# Altium project opm.PrjPcb (part 1 of 11)
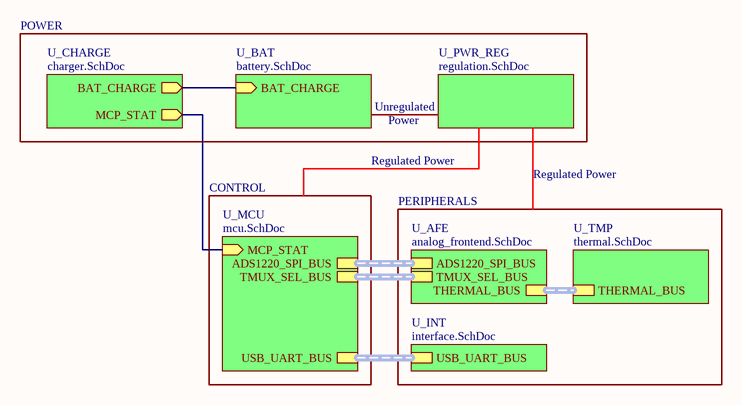
[diagram p0: opm.SchDoc]
11 sheets, 104 parts. Net scope: hierarchical (ports join the sheet entries above them; power ports are global).
Board file: opm.PcbDoc
Sheets:
  opm.SchDoc
    U_AFE = analog_frontend.SchDoc
      U_TIA2 = tia2.SchDoc
      U_TIA1 = tia1.SchDoc
      U_TIA3 = tia3.SchDoc
    U_MCU = mcu.SchDoc
    U_INT = interface.SchDoc
    U_BAT = battery.SchDoc
    U_CHARGE = charger.SchDoc
    U_PWR_REG = regulation.SchDoc
    U_TMP = thermal.SchDoc

## Sheet opm.SchDoc: Optical Power Meter
size A4; Date: 03-09-2026; Author: Peilin Perry Xu; CompanyName: N/A; DrawnBy: Peilin Perry Xu; Engineer: Peilin Perry Xu; Organization: N/A; Address1: 89 Chestnut Street, Toronto, ON, Canada; Address2: 79 Brass Drive, Richmond Hill, ON, Canada; DocumentNumber: 1; Revision: 1; SheetNumber: 1; SheetTotal: 11

### Sub-sheets
U_AFE = analog_frontend.SchDoc: ADS1220_SPI_BUS (harness ADS1220_SPI_BUS), TMUX_SEL_BUS (harness TMUX_SEL_BUS), THERMAL_BUS (harness THERMAL_BUS)
U_BAT = battery.SchDoc: BAT_CHARGE (in)
U_CHARGE = charger.SchDoc: BAT_CHARGE (out), MCP_STAT (out)
U_INT = interface.SchDoc: USB_UART_BUS (harness USB_UART_BUS)
U_MCU = mcu.SchDoc: USB_UART_BUS (harness USB_UART_BUS), ADS1220_SPI_BUS (harness ADS1220_SPI_BUS), TMUX_SEL_BUS (harness TMUX_SEL_BUS), MCP_STAT (in)
U_PWR_REG = regulation.SchDoc: no entries
U_TMP = thermal.SchDoc: THERMAL_BUS (harness THERMAL_BUS)

### Nets
NetC34_1: sheet U_BAT/BAT_CHARGE, sheet U_CHARGE/BAT_CHARGE
NetR16_2: sheet U_MCU/MCP_STAT, sheet U_CHARGE/MCP_STAT

### Buses and harness runs
harness sheet U_AFE/ADS1220_SPI_BUS = sheet U_MCU/ADS1220_SPI_BUS
harness sheet U_AFE/THERMAL_BUS = sheet U_TMP/THERMAL_BUS
harness sheet U_AFE/TMUX_SEL_BUS = sheet U_MCU/TMUX_SEL_BUS
harness sheet U_INT/USB_UART_BUS = sheet U_MCU/USB_UART_BUS

### Notes on the sheet
- POWER
- Unregulated
- Power
- CONTROL
- Regulated Power
- PERIPHERALS

## Sheet analog_frontend.SchDoc: Analog Frontend
size A4; Author: Peilin Perry Xu; CompanyName: N/A; DrawnBy: Peilin Perry Xu; Engineer: Peilin Perry Xu; Organization: N/A; Address1: 89 Chestnut Street, Toronto, ON, Canada; Address2: 79 Brass Drive, Richmond Hill, ON, Canada; DocumentNumber: 2; Revision: 1; SheetNumber: 2; SheetTotal: 11
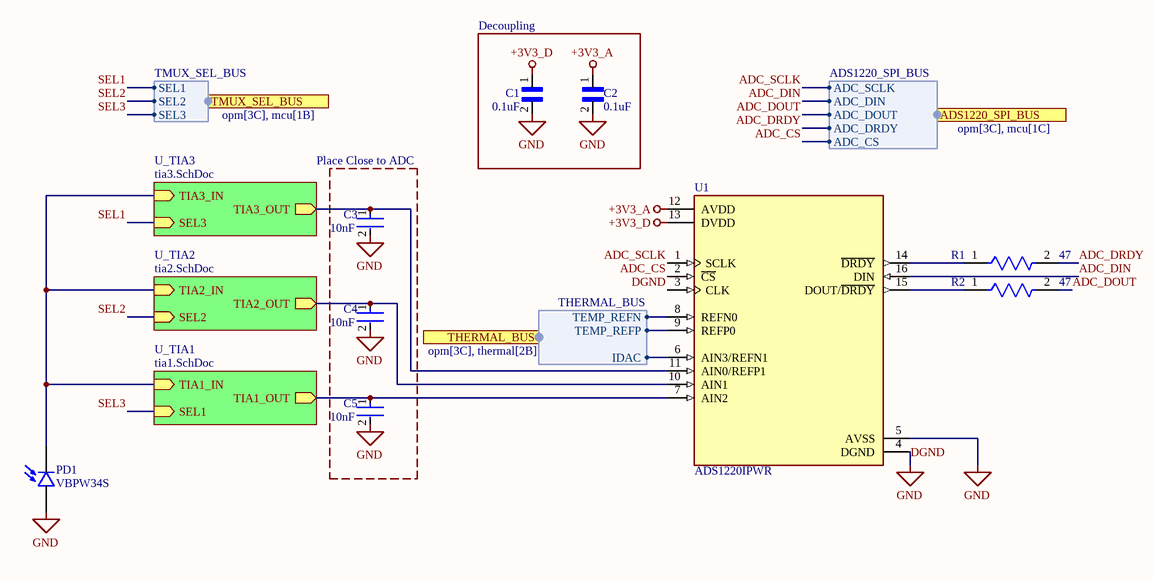
[diagram p1: analog_frontend.SchDoc]

### Parts
C1  0.1uF  [CC0603JRX7R8BB104]
C2  0.1uF  [CC0603JRX7R8BB104]
C3  10nF  [GRM1885C1H103JA01D]
C4  10nF  [GRM1885C1H103JA01D]
C5  10nF  [GRM1885C1H103JA01D]
PD1  VBPW34S  [XDCR_VBPW34S]
R1  47  [RC0603FR-07]
R2  47  [RC0603FR-07]
U1  ADS1220IPWR  [ADS1220IPWR]

### Blocks framed on the sheet
Decoupling: C1 C2

### Sub-sheets
U_TIA1 = tia1.SchDoc: TIA1_IN (in), TIA1_OUT (out), SEL1 (in)
U_TIA2 = tia2.SchDoc: TIA2_IN (in), TIA2_OUT (out), SEL2 (in)
U_TIA3 = tia3.SchDoc: TIA3_IN (in), TIA3_OUT (out), SEL3 (in)

### Ports
ADS1220_SPI_BUS (harness ADS1220_SPI_BUS, see opm[3C], mcu[1C]), THERMAL_BUS (harness THERMAL_BUS, see opm[3C], thermal[2B]), TMUX_SEL_BUS (harness TMUX_SEL_BUS, see opm[3C], mcu[1B])

### Harnesses
ADS1220_SPI_BUS: ADC_SCLK, ADC_DIN, ADC_DOUT, ADC_CS, ADC_DRDY
TMUX_SEL_BUS: SEL1, SEL2, SEL3
THERMAL_BUS: TEMP_REFN, TEMP_REFP, IDAC

### Nets
+3V3_A: C2.1 U1.12(AVDD)
+3V3_D: C1.1 U1.13(DVDD)
DGND: C1.2 C2.2 C3.2 C4.2 C5.2 PD1.A U1.3(CLK) U1.4(DGND) U1.5(AVSS)  [also labelled GND]
ADC_CS: U1.2(~{CS}) ; port ADS1220_SPI_BUS.ADC_CS
ADC_DIN: U1.16(DIN) ; port ADS1220_SPI_BUS.ADC_DIN
ADC_DOUT: R2.2 ; port ADS1220_SPI_BUS.ADC_DOUT
ADC_DRDY: R1.2 ; port ADS1220_SPI_BUS.ADC_DRDY
ADC_SCLK: U1.1(SCLK) ; port ADS1220_SPI_BUS.ADC_SCLK
SEL1: sheet U_TIA3/SEL3, port TMUX_SEL_BUS.SEL1
SEL2: sheet U_TIA2/SEL2, port TMUX_SEL_BUS.SEL2
SEL3: sheet U_TIA1/SEL1, port TMUX_SEL_BUS.SEL3
Temp_N: U1.8(REFN0) ; port THERMAL_BUS.TEMP_REFN
Temp_P: U1.9(REFP0) ; port THERMAL_BUS.TEMP_REFP
NetC3_1: C3.1 U1.11(AIN0/REFP1) ; sheet U_TIA3/TIA3_OUT
NetC4_1: C4.1 U1.10(AIN1) ; sheet U_TIA2/TIA2_OUT
NetC5_1: C5.1 U1.7(AIN2) ; sheet U_TIA1/TIA1_OUT
NetC43_1: U1.6(AIN3/REFN1) ; port THERMAL_BUS.IDAC
NetPD1_K: PD1.K(C) ; sheet U_TIA2/TIA2_IN, sheet U_TIA1/TIA1_IN, sheet U_TIA3/TIA3_IN
NetR1_1: R1.1 U1.14(~{DRDY})
NetR2_1: R2.1 U1.15(DOUT/~{DRDY})

### Notes on the sheet
- (near C3) Place Close to ADC

### Library data of the parts
C1 C2 = CC0603JRX7R8BB104: 25V 100nF X7R ±5% 0603 Multilayer Ceramic Capacitors MLCC - SMD/SMT ROHS; Manufacturer: Yageo Group; Supplier: DigiKey; Supplier Part Number: 311-1777-1-ND; Manufacturer Part Number: CC0603JRX7R8BB104; RoHS: Compliant; Category: Ceramic Capacitors; Stock: 156739; Pricing: 1=0.1, 10=0.056, 50=0.0386, 100=0.0333, 500=0.02444, 1000=0.02172 (USD); Value: 100nF; Case/Package: 0603; Case Code (Imperial): 0603; Case Code (Metric): 1608; China RoHS: Compliant; Composition: Ceramic; Depth: 800µm; Dielectric: X7R; Dielectric Material: Ceramic; Halogen Free: Halogen Free; Height: 800µm; Lead Free: Lead Free; Length: 1.6mm; Lifecycle Status: Production; Max Operating Temperature: 125°C; Min Operating Temperature: -55°C; Mounting Technology: Surface Mount; Number of Terminals: 2; Radiation Hardening: No; REACH SVHC: Yes; Schedule B: 8532240020, 8532240020|8532240020, 8532240020|8532240020|8532240020, 8532240020|8532240020|8532240020|8532240020; Termination: SMD/SMT; Thickness: 889µm; Tolerance: 5%; Voltage Rating: 25V; Voltage Rating (DC): 25V; Weight: 2.012816mg; Width: 800µm; ComponentLink1URL: https://datasheet.octopart.com:443/CC0603JRX7R8BB104-Yageo-datasheet-177165144.pdf?src-supplier=IHS; ComponentLink1Description: https://datasheet.octopart.com:443/CC0603JRX7R8BB104-Yageo-datasheet-177165144.pdf?src-supplier=IHS; ComponentLink2URL: https://datasheet.octopart.com:443/CC0603JRX7R8BB104-Yageo-datasheet-147453679.pdf?src-supplier=Farnell; ComponentLink2Description: https://datasheet.octopart.com:443/CC0603JRX7R8BB104-Yageo-datasheet-147453679.pdf?src-supplier=Farnell; ComponentLink3URL: https://datasheet.octopart.com:443/CC0603JRX7R8BB104-Yageo-datasheet-181968346.pdf?src-supplier=Farnell; ComponentLink3Description: https://datasheet.octopart.com:443/CC0603JRX7R8BB104-Yageo-datasheet-181968346.pdf?src-supplier=Farnell; ComponentLink4URL: https://datasheet.octopart.com:443/CC0603JRX7R8BB104-Yageo-datasheet-151948686.pdf?src-supplier=TME; ComponentLink4Description: https://datasheet.octopart.com:443/CC0603JRX7R8BB104-Yageo-datasheet-151948686.pdf?src-supplier=TME; ComponentLink5URL: https://datasheet.octopart.com/CC0603JRX7R8BB104-Yageo-datasheet-12526321.pdf; ComponentLink5Description: https://datasheet.octopart.com/CC0603JRX7R8BB104-Yageo-datasheet-12526321.pdf; ComponentLink6URL: https://datasheet.octopart.com/CC0603JRX7R8BB104-Yageo-datasheet-10883670.pdf; ComponentLink6Description: https://datasheet.octopart.com/CC0603JRX7R8BB104-Yageo-datasheet-10883670.pdf; ComponentLink7URL: https://datasheet.octopart.com:443/CC0603JRX7R8BB104-Yageo-datasheet-166511530.pdf?src-supplier=Future+Electronics; ComponentLink7Description: https://datasheet.octopart.com:443/CC0603JRX7R8BB104-Yageo-datasheet-166511530.pdf?src-supplier=Future+Electronics; ComponentLink8URL: https://datasheet.octopart.com:443/CC0603JRX7R8BB104-Yageo-datasheet-137700082.pdf?src-supplier=Future+Electronics; ComponentLink8Description: https://datasheet.octopart.com:443/CC0603JRX7R8BB104-Yageo-datasheet-137700082.pdf?src-supplier=Future+Electronics; ComponentLink9URL: https://datasheet.octopart.com:443/CC0603JRX7R8BB104-Yageo-datasheet-137700084.pdf?src-supplier=Future+Electronics; ComponentLink9Description: https://datasheet.octopart.com:443/CC0603JRX7R8BB104-Yageo-datasheet-137700084.pdf?src-supplier=Future+Electronics; ComponentLink10URL: https://datasheet.octopart.com:443/CC0603JRX7R8BB104-Yageo-datasheet-27626582.pdf?src-supplier=Future+Electronics; ComponentLink10Description: https://datasheet.octopart.com:443/CC0603JRX7R8BB104-Yageo-datasheet-27626582.pdf?src-supplier=Future+Electronics; ComponentLink11URL: https://datasheet.octopart.com:443/CC0603JRX7R8BB104-Yageo-datasheet-15895757.pdf?src-supplier=Future+Electronics; ComponentLink11Description: https://datasheet.octopart.com:443/CC0603JRX7R8BB104-Yageo-datasheet-15895757.pdf?src-supplier=Future+Electronics; ComponentLink12URL: https://datasheet.octopart.com:443/CC0603JRX7R8BB104-Yageo-datasheet-10911834.pdf?src-supplier=Future+Electronics; ComponentLink12Description: https://datasheet.octopart.com:443/CC0603JRX7R8BB104-Yageo-datasheet-10911834.pdf?src-supplier=Future+Electronics; ComponentLink13URL: https://datasheet.octopart.com:443/CC0603JRX7R8BB104-Yageo-datasheet-8324442.pdf?src-supplier=Future+Electronics; ComponentLink13Description: https://datasheet.octopart.com:443/CC0603JRX7R8BB104-Yageo-datasheet-8324442.pdf?src-supplier=Future+Electronics; ComponentLink14URL: https://datasheet.octopart.com:443/CC0603JRX7R8BB104-Yageo-Group-datasheet-165992755.pdf?src-supplier=ODG+(Origin+Data+Global); ComponentLink14Description: https://datasheet.octopart.com:443/CC0603JRX7R8BB104-Yageo-Group-datasheet-165992755.pdf?src-supplier=ODG+(Origin+Data+Global); ComponentLink15URL: http://sigma.octopart.com:80/rohs_statement/Surface-Mount-Ceramic-Multilayer-Capacitors%3B-General-Purpose-%26-High-Capacitance-Class-2%2C-X7R-Yageo-family-124.pdf?src-supplier=Compliance+Statements; ComponentLink15Description: http://sigma.octopart.com:80/rohs_statement/Surface-Mount-Ceramic-Multilayer-Capacitors%3B-General-Purpose-%26-High-Capacitance-Class-2%2C-X7R-Yageo-family-124.pdf?src-supplier=Compliance+Statements; ComponentLink16URL: http://sigma.octopart.com:80/reach_statement/Surface-Mount-Ceramic-Multilayer-Capacitors%3B-General-Purpose-%26-High-Capacitance-Class-2%2C-X7R-Yageo-family-125.pdf?src-supplier=Compliance+Statements; ComponentLink16Description: http://sigma.octopart.com:80/reach_statement/Surface-Mount-Ceramic-Multilayer-Capacitors%3B-General-Purpose-%26-High-Capacitance-Class-2%2C-X7R-Yageo-family-125.pdf?src-supplier=Compliance+Statements; ComponentLink17URL: http://sigma.octopart.com:80/conflict_mineral_statement/Yageo-company-3.pdf?src-supplier=Compliance+Statements; ComponentLink17Description: http://sigma.octopart.com:80/conflict_mineral_statement/Yageo-company-3.pdf?src-supplier=Compliance+Statements; ComponentLink18URL: http://sigma.octopart.com:80/rohs_statement/Yageo-company-2.pdf?src-supplier=Compliance+Statements; ComponentLink18Description: http://sigma.octopart.com:80/rohs_statement/Yageo-company-2.pdf?src-supplier=Compliance+Statements; Supplier 1: DigiKey; Supplier Part Number 1: 311-1777-1-ND
C3-C5 = GRM1885C1H103JA01D: Multilayer Ceramic Capacitor, Grm Series, 0.01 F, 5%, C0g / Np0, 50 V, 0603 [1608 Metric]; Manufacturer: Murata; Manufacturer Lifecycle Status: IN PRODUCTION; Temperature Coefficient: 30ppm/°C; Voltage: 50V; Supplier: DigiKey; Supplier Part Number: 490-9666-1-ND; Manufacturer Part Number: GRM1885C1H103JA01D; RoHS: Compliant; Category: Ceramic Capacitors; Stock: 561745; Pricing: 1=0.12, 10=0.064, 50=0.0446, 100=0.0386, 500=0.02864, 1000=0.02721 (USD); Value: 10nF; Case/Package: 0603; Case Code (Imperial): 0603; Case Code (Metric): 1608; Depth: 800µm; Dielectric: C0G; Dielectric Material: Ceramic; Height: 800µm; Lead Free: Lead Free; Lead Pitch: 500µm; Length: 1.6mm; Lifecycle Status: Production; Material: Ceramic; Max Operating Temperature: 125°C; Min Operating Temperature: -55°C; Mounting Technology: Surface Mount; Number of Terminals: 2; Packaging: Cut Tape; REACH SVHC: Yes; Schedule B: 8532240020, 8532240020|8532240020, 8532240020|8532240020|8532240020, 8532240020|8532240020|8532240020|8532240020; Termination: SMD/SMT; Thickness: 800µm; Tolerance: 5%; Voltage Rating: 50V; Voltage Rating (DC): 50V; Width: 800µm; ComponentLink1URL: https://datasheet.octopart.com:443/GRM1885C1H103JA01D-Murata-datasheet-34231350.pdf?src-supplier=Newark; ComponentLink1Description: https://datasheet.octopart.com:443/GRM1885C1H103JA01D-Murata-datasheet-34231350.pdf?src-supplier=Newark; ComponentLink2URL: https://datasheet.octopart.com:443/GRM1885C1H103JA01D-Murata-datasheet-62317145.pdf?src-supplier=element14+APAC; ComponentLink2Description: https://datasheet.octopart.com:443/GRM1885C1H103JA01D-Murata-datasheet-62317145.pdf?src-supplier=element14+APAC; ComponentLink3URL: https://datasheet.octopart.com:443/GRM1885C1H103JA01D-Murata-datasheet-15634865.pdf?src-supplier=Future+Electronics; ComponentLink3Description: https://datasheet.octopart.com:443/GRM1885C1H103JA01D-Murata-datasheet-15634865.pdf?src-supplier=Future+Electronics; ComponentLink4URL: https://datasheet.octopart.com:443/GRM1885C1H103JA01D-Murata-datasheet-22122223.pdf?src-supplier=Future+Electronics; ComponentLink4Description: https://datasheet.octopart.com:443/GRM1885C1H103JA01D-Murata-datasheet-22122223.pdf?src-supplier=Future+Electronics; ComponentLink5URL: https://datasheet.octopart.com:443/GRM1885C1H103JA01D-Murata-datasheet-44106831.pdf?src-supplier=Future+Electronics; ComponentLink5Description: https://datasheet.octopart.com:443/GRM1885C1H103JA01D-Murata-datasheet-44106831.pdf?src-supplier=Future+Electronics; ComponentLink6URL: https://datasheet.octopart.com:443/GRM1885C1H103JA01D-Murata-datasheet-165579666.pdf?src-supplier=TME; ComponentLink6Description: https://datasheet.octopart.com:443/GRM1885C1H103JA01D-Murata-datasheet-165579666.pdf?src-supplier=TME; ComponentLink7URL: https://datasheet.octopart.com:443/GRM1885C1H103JA01D-Murata-datasheet-86177052.pdf?src-supplier=TME; ComponentLink7Description: https://datasheet.octopart.com:443/GRM1885C1H103JA01D-Murata-datasheet-86177052.pdf?src-supplier=TME; ComponentLink8URL: https://datasheet.octopart.com:443/GRM1885C1H103JA01D-Murata-datasheet-141274262.pdf?src-supplier=Ciiva; ComponentLink8Description: https://datasheet.octopart.com:443/GRM1885C1H103JA01D-Murata-datasheet-141274262.pdf?src-supplier=Ciiva; ComponentLink9URL: https://datasheet.octopart.com:443/GRM1885C1H103JA01D-Murata-datasheet-140695819.pdf?src-supplier=Ciiva; ComponentLink9Description: https://datasheet.octopart.com:443/GRM1885C1H103JA01D-Murata-datasheet-140695819.pdf?src-supplier=Ciiva; ComponentLink10URL: https://datasheet.octopart.com:443/GRM1885C1H103JA01D-Murata-datasheet-138741457.pdf?src-supplier=Ciiva; ComponentLink10Description: https://datasheet.octopart.com:443/GRM1885C1H103JA01D-Murata-datasheet-138741457.pdf?src-supplier=Ciiva; ComponentLink11URL: https://datasheet.octopart.com/GRM1885C1H103JA01D-Murata-datasheet-12515295.pdf; ComponentLink11Description: https://datasheet.octopart.com/GRM1885C1H103JA01D-Murata-datasheet-12515295.pdf; ComponentLink12URL: https://datasheet.octopart.com/GRM1885C1H103JA01D-Murata-datasheet-12510076.pdf; ComponentLink12Description: https://datasheet.octopart.com/GRM1885C1H103JA01D-Murata-datasheet-12510076.pdf; ComponentLink13URL: https://datasheet.octopart.com/GRM1885C1H103JA01D-Murata-datasheet-11978611.pdf; ComponentLink13Description: https://datasheet.octopart.com/GRM1885C1H103JA01D-Murata-datasheet-11978611.pdf; ComponentLink14URL: https://datasheet.octopart.com/GRM1885C1H103JA01D-Murata-datasheet-10025737.pdf; ComponentLink14Description: https://datasheet.octopart.com/GRM1885C1H103JA01D-Murata-datasheet-10025737.pdf; ComponentLink15URL: https://datasheet.octopart.com/GRM1885C1H103JA01D-Murata-datasheet-8819587.pdf; ComponentLink15Description: https://datasheet.octopart.com/GRM1885C1H103JA01D-Murata-datasheet-8819587.pdf; ComponentLink16URL: http://sigma.octopart.com:80/reach_statement/Murata-company-16.pdf?src-supplier=Compliance+Statements; ComponentLink16Description: http://sigma.octopart.com:80/reach_statement/Murata-company-16.pdf?src-supplier=Compliance+Statements; Supplier 1: DigiKey; Supplier Part Number 1: 490-9666-1-ND
PD1 = VBPW34S: IR-photodiode Photoelectric current: 45...55 uA Wavelength of max. photosensitivity: 940 nm; Manufacturer: Vishay; Breakdown Voltage: 60V; Dark Current: 30nA; Diode Type: PIN; Fall Time: 100ns; Forward Current: 50mA; Forward Voltage: 1.3V; Max Power Dissipation: 215mW; Number of Circuits: 1; Peak Wavelength: 940nm; Viewing Angle: 130°; Supplier: DigiKey; Supplier Part Number: 751-1500-6-ND; Manufacturer Part Number: VBPW34S; RoHS: Compliant; Category: Photodiodes; Stock: 49982; Pricing: 1=1.17, 10=0.822, 100=0.6118, 500=0.5182 (USD); Case/Package: SMD/SMT; Contact Plating: Tin; Height: 1.2mm; Introduction Date: 2009-10-04; Lead Free: Lead Free; Length: 4.4mm; Lifecycle Status: Production; Max Operating Temperature: 100°C; Max Reverse Voltage (DC): 60V; Min Operating Temperature: -40°C; Mounting Technology: Surface Mount; Pins: 2; Power Dissipation: 215mW; Radiation Hardening: No; REACH SVHC: Yes; Response Time: 100ns; Reverse Breakdown Voltage: 60V; Reverse Voltage: 60V; Reverse Voltage (DC): 60V; Rise Time: 100ns; Schedule B: 8541406010, 8541406010|8541406010|8541406010|8541406010|8541406010; Wavelength: 940nm; Width: 3.9mm; ComponentLink1URL: https://datasheet.octopart.com:443/VBPW34S-Vishay-datasheet-181477396.pdf?src-supplier=IHS; ComponentLink1Description: https://datasheet.octopart.com:443/VBPW34S-Vishay-datasheet-181477396.pdf?src-supplier=IHS; ComponentLink2URL: https://datasheet.octopart.com:443/VBPW34S-Vishay-datasheet-141435336.pdf?src-supplier=Upverter; ComponentLink2Description: https://datasheet.octopart.com:443/VBPW34S-Vishay-datasheet-141435336.pdf?src-supplier=Upverter; ComponentLink3URL: https://datasheet.octopart.com:443/VBPW34S-Vishay-datasheet-8636772.pdf?src-supplier=Farnell; ComponentLink3Description: https://datasheet.octopart.com:443/VBPW34S-Vishay-datasheet-8636772.pdf?src-supplier=Farnell; ComponentLink4URL: https://datasheet.octopart.com:443/VBPW34S-Vishay-datasheet-24897338.pdf?src-supplier=Farnell; ComponentLink4Description: https://datasheet.octopart.com:443/VBPW34S-Vishay-datasheet-24897338.pdf?src-supplier=Farnell; ComponentLink5URL: https://datasheet.octopart.com:443/VBPW34S-Vishay-datasheet-41195834.pdf?src-supplier=Farnell; ComponentLink5Description: https://datasheet.octopart.com:443/VBPW34S-Vishay-datasheet-41195834.pdf?src-supplier=Farnell; ComponentLink6URL: https://datasheet.octopart.com:443/VBPW34S-Vishay-datasheet-62319496.pdf?src-supplier=Newark; ComponentLink6Description: https://datasheet.octopart.com:443/VBPW34S-Vishay-datasheet-62319496.pdf?src-supplier=Newark; ComponentLink7URL: https://datasheet.octopart.com:443/VBPW34S-Vishay-datasheet-8820987.pdf?src-supplier=element14+APAC; ComponentLink7Description: https://datasheet.octopart.com:443/VBPW34S-Vishay-datasheet-8820987.pdf?src-supplier=element14+APAC; ComponentLink8URL: https://datasheet.octopart.com:443/VBPW34S-Vishay-datasheet-108049364.pdf?src-supplier=Future+Electronics; ComponentLink8Description: https://datasheet.octopart.com:443/VBPW34S-Vishay-datasheet-108049364.pdf?src-supplier=Future+Electronics; ComponentLink9URL: https://datasheet.octopart.com:443/VBPW34S-Vishay-datasheet-81857105.pdf?src-supplier=TME; ComponentLink9Description: https://datasheet.octopart.com:443/VBPW34S-Vishay-datasheet-81857105.pdf?src-supplier=TME; ComponentLink10URL: http://sigma.octopart.com:80/rohs_statement/Vishay-company-15.pdf?src-supplier=Compliance+Statements; ComponentLink10Description: http://sigma.octopart.com:80/rohs_statement/Vishay-company-15.pdf?src-supplier=Compliance+Statements; Supplier 1: DigiKey; Supplier Part Number 1: 751-1500-1-ND
R1 R2 = RC0603FR-0747RL: 100mW Thick Film Resistors 75V ±100ppm/℃ ±1% 47Ω 0603 Chip Resistor - Surface Mount ROHS; Manufacturer: Yageo Group; Temperature Coefficient: 100ppm/°C; Voltage Rating: 50V; Supplier: DigiKey; Supplier Part Number: 311-47.0HRCT-ND; Manufacturer Part Number: RC0603FR-0747RL; RoHS: Compliant; Category: Chip SMD Resistors; Stock: 424421; Pricing: 1=0.1, 10=0.008, 25=0.0072, 50=0.0062, 100=0.0057 (USD); Case/Package: 0603; Case Code (Imperial): 0603; Case Code (Metric): 1608; China RoHS: Non-Compliant; Composition: Thick Film; Depth: 800µm; Features: Moisture Resistant; Height: 450µm; Lead Free: Lead Free; Length: 1.6mm; Lifecycle Status: Production; Max Operating Temperature: 155°C; Max Power Dissipation: 100mW; Military Standard: Not; Min Operating Temperature: -55°C; Mounting Technology: Surface Mount; Pins: 2; Number of Terminals: 2; Number of Terminations: 2; Packaging: Tape and Reel; Power Dissipation: 100mW; Power Rating: 100mW; REACH SVHC: Yes; Value: 47Ω; Schedule B: 8533210045, 8533210045|8533210045, 8533210045|8533210045|8533210045, 8533210045|8533210045|8533210045|8533210045; Termination: SMD/SMT; Tolerance: 1%; Voltage Rating (AC): 50V; Voltage Rating (DC): 50V; Weight: 2.012816mg; Width: 800µm; Working Voltage: 75V; ComponentLink1URL: https://datasheet.octopart.com:443/RC0603FR-0747RL-Yageo-datasheet-175887523.pdf?src-supplier=IHS; ComponentLink1Description: https://datasheet.octopart.com:443/RC0603FR-0747RL-Yageo-datasheet-175887523.pdf?src-supplier=IHS; ComponentLink2URL: https://datasheet.octopart.com:443/RC0603FR-0747RL-Yageo-datasheet-62067350.pdf?src-supplier=Newark; ComponentLink2Description: https://datasheet.octopart.com:443/RC0603FR-0747RL-Yageo-datasheet-62067350.pdf?src-supplier=Newark; ComponentLink3URL: https://datasheet.octopart.com:443/RC0603FR-0747RL-Yageo-datasheet-12596169.pdf?src-supplier=Newark; ComponentLink3Description: https://datasheet.octopart.com:443/RC0603FR-0747RL-Yageo-datasheet-12596169.pdf?src-supplier=Newark; ComponentLink4URL: https://datasheet.octopart.com:443/RC0603FR-0747RL-Yageo-datasheet-164759695.pdf?src-supplier=Upverter; ComponentLink4Description: https://datasheet.octopart.com:443/RC0603FR-0747RL-Yageo-datasheet-164759695.pdf?src-supplier=Upverter; ComponentLink5URL: https://datasheet.octopart.com:443/RC0603FR-0747RL-Yageo-datasheet-103092701.pdf?src-supplier=Upverter; ComponentLink5Description: https://datasheet.octopart.com:443/RC0603FR-0747RL-Yageo-datasheet-103092701.pdf?src-supplier=Upverter; ComponentLink6URL: https://datasheet.octopart.com:443/RC0603FR-0747RL-Yageo-datasheet-141435368.pdf?src-supplier=Upverter; ComponentLink6Description: https://datasheet.octopart.com:443/RC0603FR-0747RL-Yageo-datasheet-141435368.pdf?src-supplier=Upverter; ComponentLink7URL: https://datasheet.octopart.com:443/RC0603FR-0747RL-Yageo-Group-datasheet-190305687.pdf?src-supplier=Future+Electronics; ComponentLink7Description: https://datasheet.octopart.com:443/RC0603FR-0747RL-Yageo-Group-datasheet-190305687.pdf?src-supplier=Future+Electronics; ComponentLink8URL: https://datasheet.octopart.com:443/RC0603FR-0747RL-Yageo-datasheet-137700087.pdf?src-supplier=Future+Electronics; ComponentLink8Description: https://datasheet.octopart.com:443/RC0603FR-0747RL-Yageo-datasheet-137700087.pdf?src-supplier=Future+Electronics; ComponentLink9URL: https://datasheet.octopart.com:443/RC0603FR-0747RL-Yageo-datasheet-127823281.pdf?src-supplier=Future+Electronics; ComponentLink9Description: https://datasheet.octopart.com:443/RC0603FR-0747RL-Yageo-datasheet-127823281.pdf?src-supplier=Future+Electronics; ComponentLink10URL: https://datasheet.octopart.com:443/RC0603FR-0747RL-Yageo-datasheet-27584510.pdf?src-supplier=Future+Electronics; ComponentLink10Description: https://datasheet.octopart.com:443/RC0603FR-0747RL-Yageo-datasheet-27584510.pdf?src-supplier=Future+Electronics; ComponentLink11URL: https://datasheet.octopart.com:443/RC0603FR-0747RL-Yageo-datasheet-15599030.pdf?src-supplier=Future+Electronics; ComponentLink11Description: https://datasheet.octopart.com:443/RC0603FR-0747RL-Yageo-datasheet-15599030.pdf?src-supplier=Future+Electronics; ComponentLink12URL: https://datasheet.octopart.com:443/RC0603FR-0747RL-Yageo-datasheet-503470.pdf?src-supplier=Future+Electronics; ComponentLink12Description: https://datasheet.octopart.com:443/RC0603FR-0747RL-Yageo-datasheet-503470.pdf?src-supplier=Future+Electronics; ComponentLink13URL: https://datasheet.octopart.com:443/RC0603FR-0747RL-Yageo-datasheet-8328172.pdf?src-supplier=element14+APAC; ComponentLink13Description: https://datasheet.octopart.com:443/RC0603FR-0747RL-Yageo-datasheet-8328172.pdf?src-supplier=element14+APAC; ComponentLink14URL: https://datasheet.octopart.com:443/RC0603FR-0747RL-Yageo-datasheet-34211833.pdf?src-supplier=element14+APAC; ComponentLink14Description: https://datasheet.octopart.com:443/RC0603FR-0747RL-Yageo-datasheet-34211833.pdf?src-supplier=element14+APAC; ComponentLink15URL: https://datasheet.octopart.com:443/RC0603FR-0747RL-Yageo-datasheet-148775077.pdf?src-supplier=TME; ComponentLink15Description: https://datasheet.octopart.com:443/RC0603FR-0747RL-Yageo-datasheet-148775077.pdf?src-supplier=TME; ComponentLink16URL: https://datasheet.octopart.com/RC0603FR-0747RL-Yageo-datasheet-73766026.pdf; ComponentLink16Description: https://datasheet.octopart.com/RC0603FR-0747RL-Yageo-datasheet-73766026.pdf; ComponentLink17URL: https://datasheet.octopart.com:443/RC0603FR-0747RL-Yageo-datasheet-13691069.pdf?src-supplier=Farnell; ComponentLink17Description: https://datasheet.octopart.com:443/RC0603FR-0747RL-Yageo-datasheet-13691069.pdf?src-supplier=Farnell; ComponentLink18URL: https://datasheet.octopart.com:443/RC0603FR-0747RL-Yageo-datasheet-118562.pdf?src-supplier=DigiKey; ComponentLink18Description: https://datasheet.octopart.com:443/RC0603FR-0747RL-Yageo-datasheet-118562.pdf?src-supplier=DigiKey; ComponentLink19URL: http://sigma.octopart.com:80/conflict_mineral_statement/Yageo-company-3.pdf?src-supplier=Compliance+Statements; ComponentLink19Description: http://sigma.octopart.com:80/conflict_mineral_statement/Yageo-company-3.pdf?src-supplier=Compliance+Statements; ComponentLink20URL: http://sigma.octopart.com:80/rohs_statement/Yageo-company-2.pdf?src-supplier=Compliance+Statements; ComponentLink20Description: http://sigma.octopart.com:80/rohs_statement/Yageo-company-2.pdf?src-supplier=Compliance+Statements; Supplier 1: DigiKey; Supplier Part Number 1: 311-47.0HRCT-ND
U1 = ADS1220IPWR: Single ADC Delta-Sigma 2ksps 24-bit Serial (5-Wire, 4-Wire, 3-Wire, SPI) 16-Pin TSSOP T/R; Manufacturer: Texas Instruments; Manufacturer Lifecycle Status: ACTIVE; Max Power Dissipation: 1.4mW; Max Supply Voltage: 5.5V; Min Supply Voltage: 2.3V; Number of A/D Converters: 1; Number of Analog Inputs: 4; Number of Bits: 24; Operating Supply Voltage: 3.3V; Polarity: Bipolar, Unipolar; Power Dissipation: 2.1mW; Resolution: 3B; Supply Type: Analog, Digital, Dual; Supplier: DigiKey; Supplier Part Number: 296-39851-1-ND; Manufacturer Part Number: ADS1220IPWR; RoHS: Compliant; Category: Analog to Digital Converters (ADCs); Stock: 4569; Pricing: 1=7.92, 10=6.133, 25=5.686, 100=5.1941, 250=4.95956, 500=4.81824, 1000=4.70193 (USD); Case/Package: TSSOP; Contact Plating: Gold; Height: 1.2mm; Interface: SPI; Lead Free: Lead Free; Length: 5mm; Lifecycle Status: Production; Max Operating Temperature: 125°C; Min Operating Temperature: -40°C; Mounting Technology: Surface Mount; Number of Channels: 1; Number of Converters: 1; Number of Elements: 1; Number of Inputs: 4; Pins: 16; Radiation Hardening: No; Sampling Rate: 2ksps; Schedule B: 8542390000; Thickness: 1mm; Width: 4.4mm; ComponentLink1URL: https://sigma.octopart.com:443/189718192/technical_drawing/Texas-Instruments-ADS1220IPWR.pdf?src-supplier=Texas+Instruments; ComponentLink1Description: https://sigma.octopart.com:443/189718192/technical_drawing/Texas-Instruments-ADS1220IPWR.pdf?src-supplier=Texas+Instruments; ComponentLink2URL: https://octopart.com:443/opatz8j6/c1?t=6PgF7JLWIi22LldaOU7M9y1v-cYg4Zx7_3q84e-aqucDQscnjc-S0rbNCtxfrj18GP6nvaPS8hKq6fMUxCIswLCbG2-dvnYJuWgl1rq_FtcofGa7EIOjUhmxvGKxA7uk6K91NUMs9UXrS0ReJ-JcvGY3bGLvGZ5rREyppGIXq450cGXR3FmMwE-n39kOiK-BMufdvIuBSiXKYK1qV1ofaLSZP7MhaDD4afL91g_UwCXPE41i8iP2UuNrebLy3M0-Xcu2NAycJeL9FSvTqO4LoGlJek2cP86nYTTT_A0ut_GEOGIMv8YoqPZNZeOUbLtwo4nM7ISbcPk-Soon6M-a5rYhmKOY18cLZ5XB9zEAmb6SDXepHsPpEeu6ItOn8zgjHQyxYwQ&src-supplier=Texas+Instruments; ComponentLink2Description: https://octopart.com:443/opatz8j6/c1?t=6PgF7JLWIi22LldaOU7M9y1v-cYg4Zx7_3q84e-aqucDQscnjc-S0rbNCtxfrj18GP6nvaPS8hKq6fMUxCIswLCbG2-dvnYJuWgl1rq_FtcofGa7EIOjUhmxvGKxA7uk6K91NUMs9UXrS0ReJ-JcvGY3bGLvGZ5rREyppGIXq450cGXR3FmMwE-n39kOiK-BMufdvIuBSiXKYK1qV1ofaLSZP7MhaDD4afL91g_UwCXPE41i8iP2UuNrebLy3M0-Xcu2NAycJeL9FSvTqO4LoGlJek2cP86nYTTT_A0ut_GEOGIMv8YoqPZNZeOUbLtwo4nM7ISbcPk-Soon6M-a5rYhmKOY18cLZ5XB9zEAmb6SDXepHsPpEeu6ItOn8zgjHQyxYwQ&src-supplier=Texas+Instruments; ComponentLink3URL: https://sigma.octopart.com:443/116621398/technical_drawing/Texas-Instruments-ADS1220IPWR.pdf?src-supplier=Texas+Instruments; ComponentLink3Description: https://sigma.octopart.com:443/116621398/technical_drawing/Texas-Instruments-ADS1220IPWR.pdf?src-supplier=Texas+Instruments; ComponentLink4URL: https://datasheet.octopart.com:443/ADS1220IPWR-Texas-Instruments-datasheet-37484719.pdf?src-supplier=Texas+Instruments; ComponentLink4Description: https://datasheet.octopart.com:443/ADS1220IPWR-Texas-Instruments-datasheet-37484719.pdf?src-supplier=Texas+Instruments; ComponentLink5URL: https://datasheet.octopart.com:443/ADS1220IPWR-Texas-Instruments-datasheet-16941236.pdf?src-supplier=Texas+Instruments; ComponentLink5Description: https://datasheet.octopart.com:443/ADS1220IPWR-Texas-Instruments-datasheet-16941236.pdf?src-supplier=Texas+Instruments; ComponentLink6URL: https://datasheet.octopart.com:443/ADS1220IPWR-Texas-Instruments-datasheet-15761565.pdf?src-supplier=Texas+Instruments; ComponentLink6Description: https://datasheet.octopart.com:443/ADS1220IPWR-Texas-Instruments-datasheet-15761565.pdf?src-supplier=Texas+Instruments; ComponentLink7URL: https://sigma.octopart.com:443/49249815/technical_drawing/Texas-Instruments-ADS1220IPWR.pdf?src-supplier=Texas+Instruments; ComponentLink7Description: https://sigma.octopart.com:443/49249815/technical_drawing/Texas-Instruments-ADS1220IPWR.pdf?src-supplier=Texas+Instruments; ComponentLink8URL: https://datasheet.octopart.com:443/ADS1220IPWR-Texas-Instruments-datasheet-159675426.pdf?src-supplier=SHENGYU+ELECTRONICS; ComponentLink8Description: https://datasheet.octopart.com:443/ADS1220IPWR-Texas-Instruments-datasheet-159675426.pdf?src-supplier=SHENGYU+ELECTRONICS; ComponentLink9URL: https://datasheet.octopart.com:443/ADS1220IPWR-Texas-Instruments-datasheet-165986363.pdf?src-supplier=LCSC; ComponentLink9Description: https://datasheet.octopart.com:443/ADS1220IPWR-Texas-Instruments-datasheet-165986363.pdf?src-supplier=LCSC; ComponentLink10URL: http://sigma.octopart.com:80/reach_statement/Texas-Instruments-company-64.pdf?src-supplier=Compliance+Statements; ComponentLink10Description: http://sigma.octopart.com:80/reach_statement/Texas-Instruments-company-64.pdf?src-supplier=Compliance+Statements; ComponentLink11URL: http://sigma.octopart.com:80/conflict_mineral_statement/Texas-Instruments-company-63.pdf?src-supplier=Compliance+Statements; ComponentLink11Description: http://sigma.octopart.com:80/conflict_mineral_statement/Texas-Instruments-company-63.pdf?src-supplier=Compliance+Statements; Supplier 1: DigiKey; Supplier Part Number 1: 296-39851-1-ND